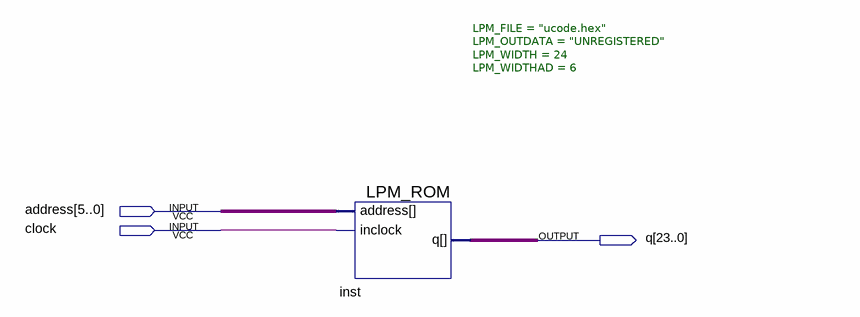
[diagram p0: schematic sheet]
// Quartus schematic ROM.bdf as structural Verilog: 1 symbols, 3 pins
module ROM (
  input  [5:0] address,
  input  clock,
  output [23:0] q
);

  LPM_ROM #(.LPM_FILE("ucode.hex"), .LPM_OUTDATA("UNREGISTERED"), .LPM_WIDTH(24), .LPM_WIDTHAD(6)) inst (
    .address(address), .inclock(clock), .q(q));
endmodule
